# Altium schematic sheet [03] - HELPFUL INFO.SchDoc: HELPFUL INFO
size 433 x 279 mm; Author: ZAG; DrawnBy: ZAG; SheetNumber: 3; SheetTotal: 4; PageSetup: Record=PageOptions|CenterHorizontal=True|CenterVertical=True|PrintScale=0.96|XCorrection=1.00|YCorrection=1.00|PrintKind=2|BorderSize=5000000|LeftOffset=0|BottomOffset=0|Orientation=2|PaperLength=4318|PaperWidth=2794|Scale=100|PaperSource=15|PrintQuality=600|MediaType=1|DitherType=10|PaperKind=11x17|PrintScaleMode=1; PCBRevision: 01; SchRevision: 01; Project: HOT AIR BALLOON; SchStatus: PRELIMINARY
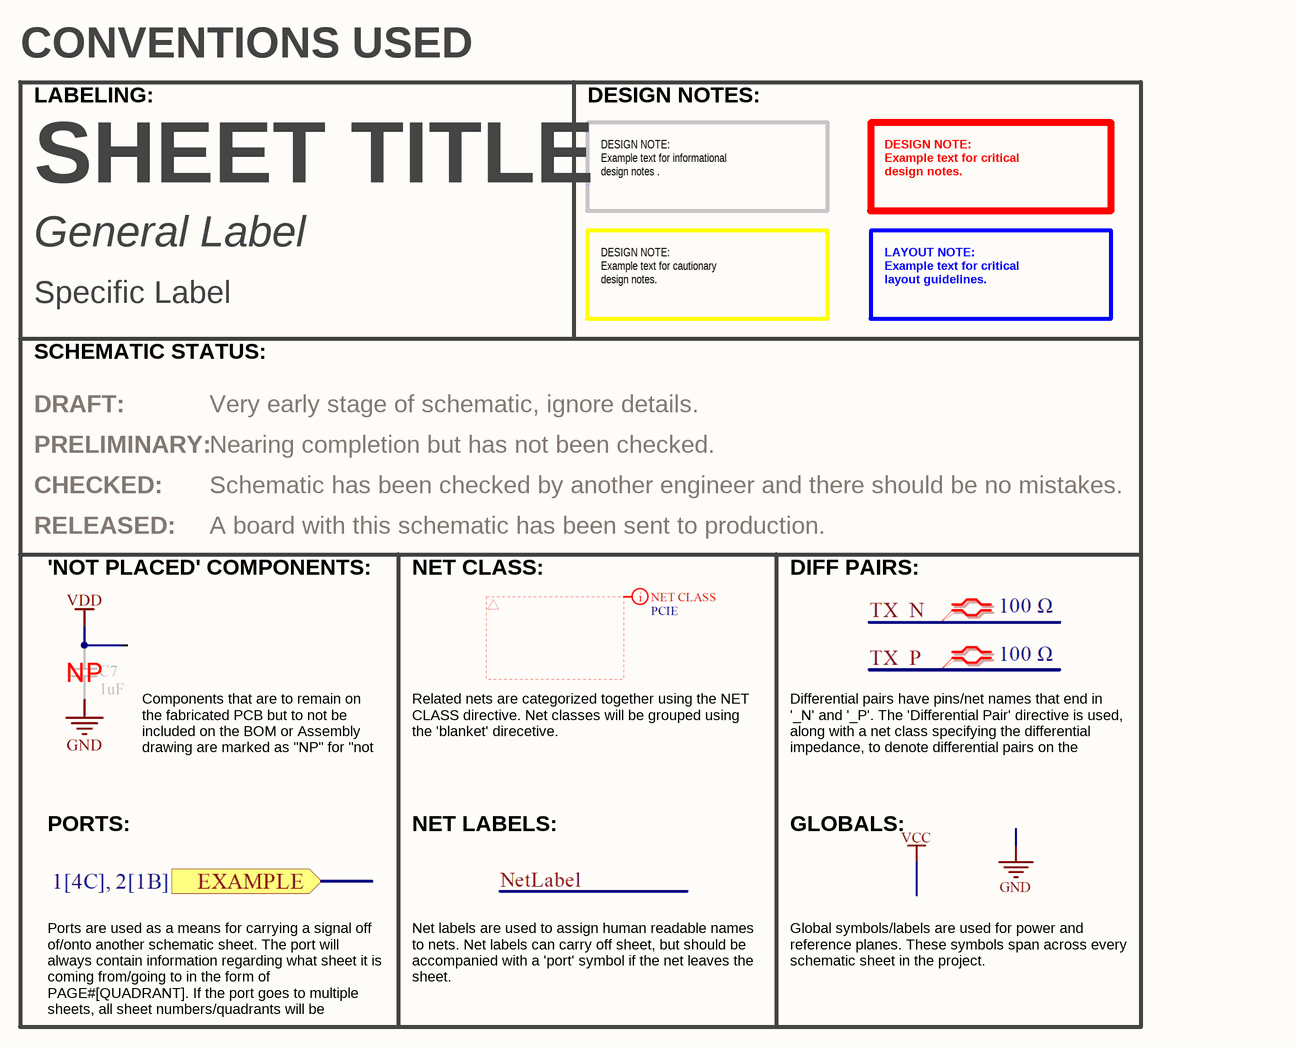
[diagram p0: [03] - HELPFUL INFO.SchDoc]

## Notes on the sheet
- CONVENTIONS USED
- LABELING:
- DESIGN NOTES:
- SHEET TITLE
- DESIGN NOTE:
  Example text for informational
  design notes .
- DESIGN NOTE:
  Example text for critical
  design notes.
- General Label
- Specific Label
- DESIGN NOTE:
  Example text for cautionary
  design notes.
- LAYOUT NOTE:
  Example text for critical
  layout guidelines.
- SCHEMATIC STATUS:
- PRELIMINARY:
- DRAFT:
- Very early stage of schematic, ignore details.
- Nearing completion but has not been checked.
- RELEASED:
- CHECKED:
- Schematic has been checked by another engineer and there should be no mistakes.
- A board with this schematic has been sent to production.
- 'NOT PLACED' COMPONENTS:
- NET CLASS:
- DIFF PAIRS:
- Related nets are categorized together using the NET CLASS directive. Net classes will be grouped using the 'blanket' direcetive.
- Components that are to remain on the fabricated PCB but to not be included on the BOM or Assembly drawing are marked as "NP" for "not placed".
- Differential pairs have pins/net names that end in '_N' and '_P'. The 'Differential Pair' directive is used, along with a net class specifying the differential impedance, to denote differential pairs on the schematic.
- PORTS:
- NET LABELS:
- GLOBALS:
- Ports are used as a means for carrying a signal off of/onto another schematic sheet. The port will always contain information regarding what sheet it is coming from/going to in the form of PAGE#[QUADRANT]. If the port goes to multiple sheets, all sheet numbers/quadrants will be displayed next to the port.
- Net labels are used to assign human readable names to nets. Net labels can carry off sheet, but should be accompanied with a 'port' symbol if the net leaves the sheet.
- Global symbols/labels are used for power and reference planes. These symbols span across every schematic sheet in the project.
- SCH REV:
- PROJECT NAME
- PCB REV:
- DATE:
- DRAWN BY
- CONTACT
- MANUFACTURER, OR SALE OF PROCESSES OR PRODUCTS WITHOUT THE EXPRESSED WRITTEN CONSENT OF
- THE INFORMATION CONTAINED HEREIN IS DEEMED TO BE CONFIDENTIAL, PROPRIETARY, AND A TRADE SECRET OF
- THIS INFORMATION MAY NOT BE USED, REPRODUCED, OR DISCLOSED AS THE DIRECT OR INDIRECT BASIS FOR THE DEVELOPMENT,
- SHEET
- MULE LABS, LLC
- www.mule-labs.com <http://www.mule-labs.com>
- OF
- SIZE: B
- DO NOT SCALE DRAWING